# EAGLE board EPS (EAGLE 7.5.0)
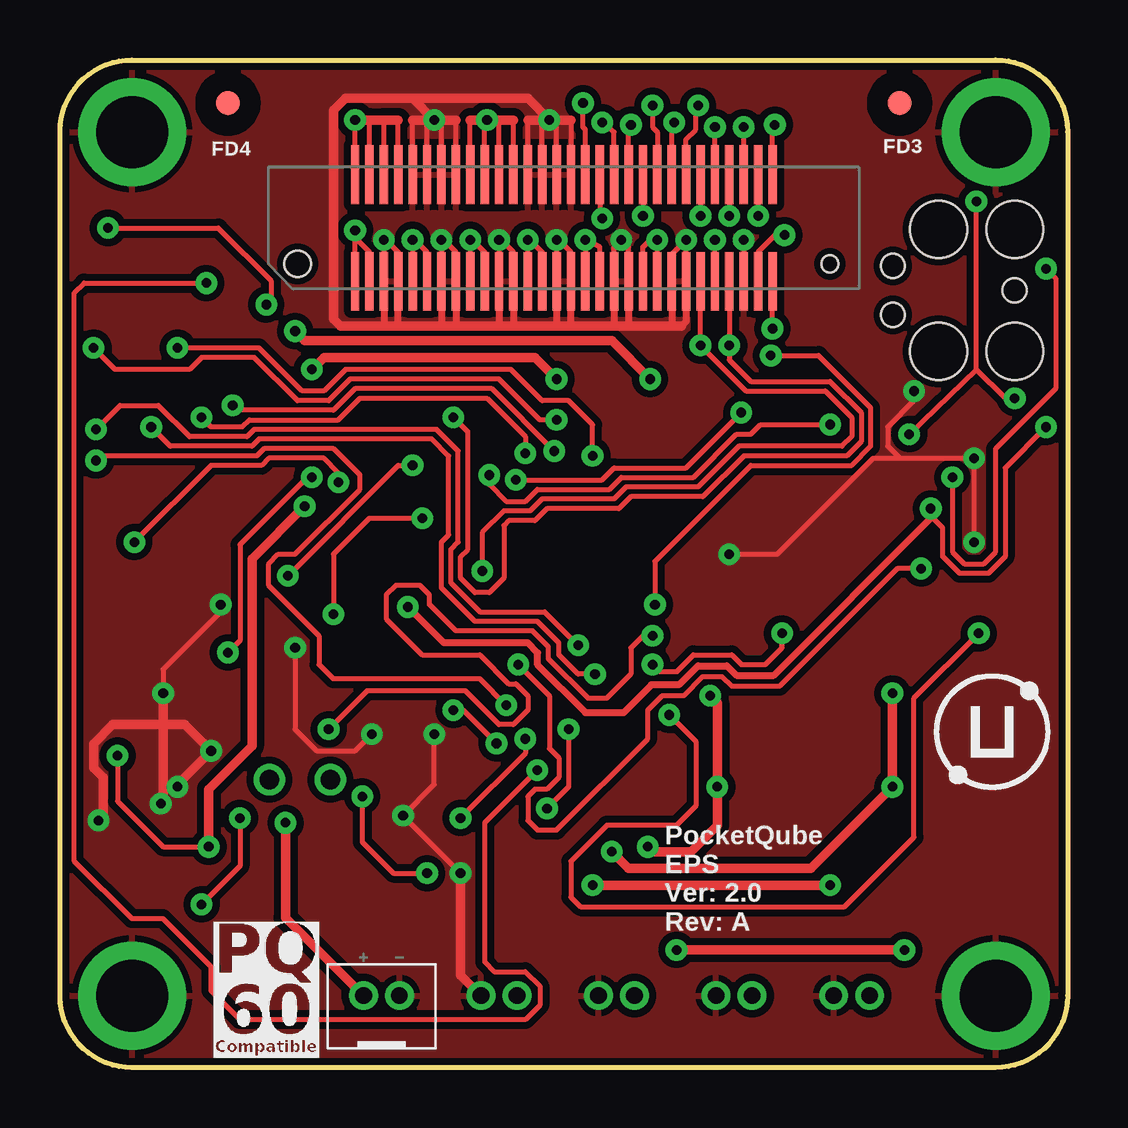
[diagram p3: board, top side]
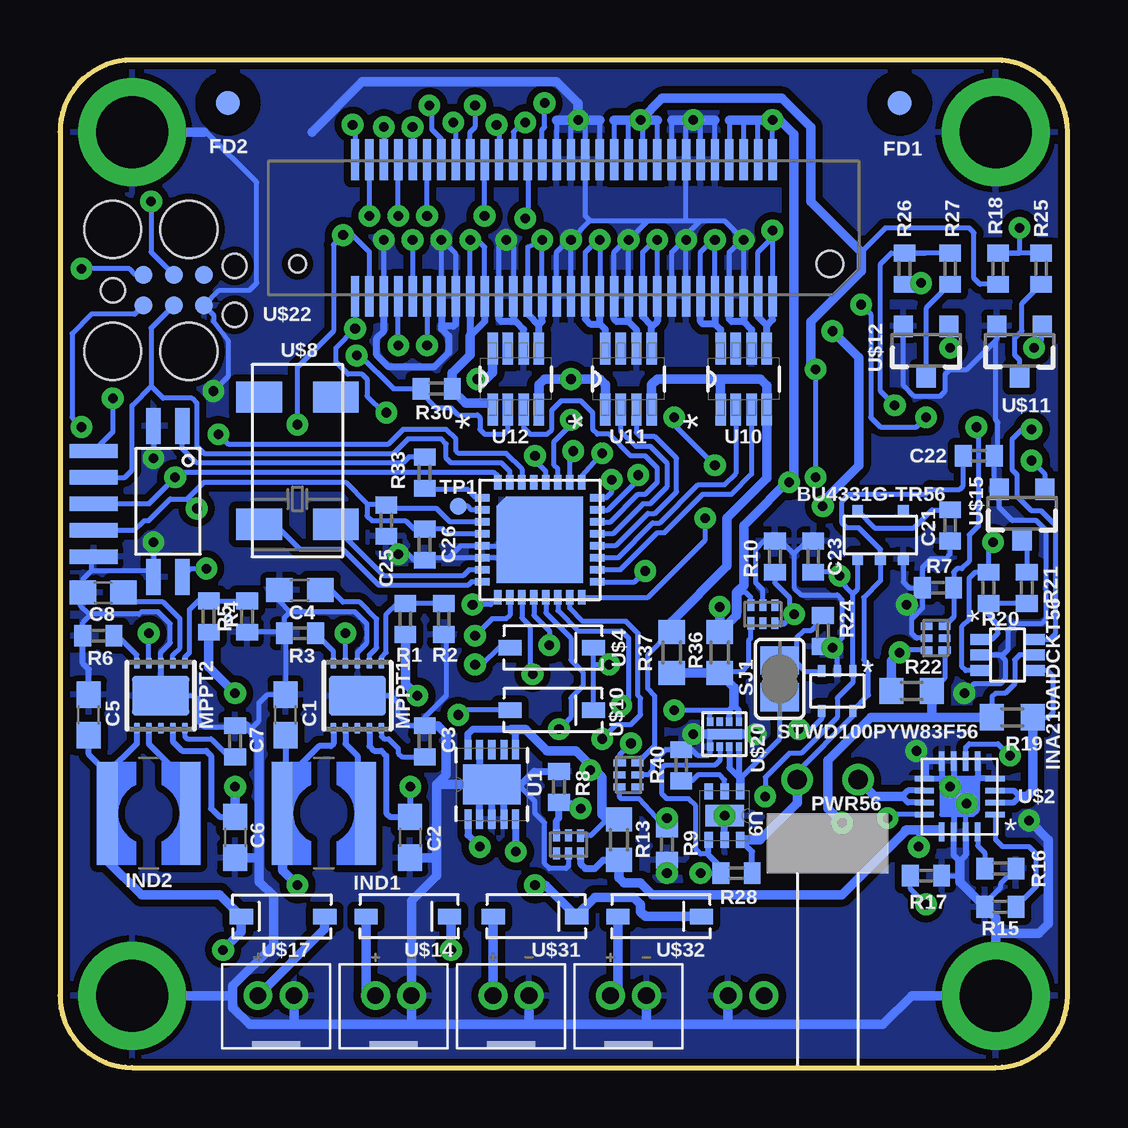
[diagram p4: board, bottom side, seen from below]

Size 42 x 42 mm. Coordinates in mm from the lower left corner, seen from the top.
Outline: 0,39 arc-90 3,42 39,42 arc-90 42,39 42,3 arc-90 39,0 3,0 arc-90 0,3 0,39
Copper layers (1*16): Top 0.035mm / dielectric 1.5mm / Bottom 0.035mm
Design rules "pcbtrain *": minimum track width 0.2mm, minimum drill 0.4mm, track to track 0.2mm, track to pad 0.2mm, pad to pad 0.2mm, via to via 0.2mm, smd to smd 0mil, copper to edge 10mil, drill to drill 0.2mm, minimum pad ring 10mil, minimum via ring 10mil, stop-mask expansion 0.125mm, vias tented up to drill 0.5mm, thermal gap 10mil
Milling: 8 lines

## Footprints (pad centres in the part's own frame; a part is rotated, then mirrored left to right if it is on the bottom)
JST-B2B-ZR = drill 0.7 pad 1.1: P$1 -0.75,0; P$2 0.75,0
SSOP5 = smd 0.45 x 0.5: 1 -0.95,-1; 2 0,-1; 3 0.95,-1; 4 0.95,1; 5 -0.95,1
C0603 = smd 1.1 x 1: 1 -0.85,0; 2 0.85,0
C0402 = smd 0.7 x 0.9: 1 -0.65,0; 2 0.65,0
FIDUCIAL_1MM = smd 1 x 1: 1 0,0
SC-70 = smd 0.45 x 0.9: 1 -0.65,-1.1; 2 0,-1.1; 3 0.65,-1.1; 4 0.65,1.1; 5 0,1.1; 6 -0.65,1.1
WE-TPC-744031100 = smd 4.3 x 0.85: P$1 0,-1.725; P$3 0,1.725
DFN-3X3 = smd 0.25 x 0.45: 1 -1,-1.35; 2 -0.5,-1.35; 3 0,-1.35; 4 0.5,-1.35; 5 1,-1.35; 6 1,1.35; 7 0.5,1.35; 8 0,1.35; 9 -0.5,1.35; 10 -1,1.35 | smd 2.38 x 1.65: EXP 0,0
FX8C-060P-SV(92) = smd 0.35 x 2.45: P$1 -8.7,-2.225; P$2 -8.1,-2.225; P$3 -7.5,-2.225; P$4 -6.9,-2.225; P$5 -6.3,-2.225; P$6 -5.7,-2.225; P$7 -5.1,-2.225; P$8 -4.5,-2.225; P$9 -3.9,-2.225; P$10 -3.3,-2.225; P$11 -2.7,-2.225; P$12 -2.1,-2.225; P$13 -1.5,-2.225; P$14 -0.9,-2.225; P$15 -0.3,-2.225; P$16 0.3,-2.225; P$17 0.9,-2.225; P$18 1.5,-2.225; P$19 2.1,-2.225; P$20 2.7,-2.225; P$21 3.3,-2.225; P$22 3.9,-2.225; P$23 4.5,-2.225; P$24 5.1,-2.225; P$25 5.7,-2.225; P$26 6.3,-2.225; P$27 6.9,-2.225; P$28 7.5,-2.225; P$29 8.1,-2.225; P$30 8.7,-2.225; P$31 8.7,2.225; P$32 8.1,2.225; P$33 7.5,2.225; P$34 6.9,2.225; P$35 6.3,2.225; P$36 5.7,2.225; P$37 5.1,2.225; P$38 4.5,2.225; P$39 3.9,2.225; P$40 3.3,2.225; P$41 2.7,2.225; P$42 2.1,2.225; P$43 1.5,2.225; P$44 0.9,2.225; P$45 0.3,2.225; P$46 -0.3,2.225; P$47 -0.9,2.225; P$48 -1.5,2.225; P$49 -2.1,2.225; P$50 -2.7,2.225; P$51 -3.3,2.225; P$52 -3.9,2.225; P$53 -4.5,2.225; P$54 -5.1,2.225; P$55 -5.7,2.225; P$56 -6.3,2.225; P$57 -6.9,2.225; P$58 -7.5,2.225; P$59 -8.1,2.225; P$60 -8.7,2.225 | hole 1.1: -11.1,-1.499 | hole 0.7: 11.1,-1.499
FX8C-060S-SV(92) = smd 0.35 x 1.7: P$1 -8.7,2.85; P$2 -8.1,2.85; P$3 -7.5,2.85; P$4 -6.9,2.85; P$5 -6.3,2.85; P$6 -5.7,2.85; P$7 -5.1,2.85; P$8 -4.5,2.85; P$9 -3.9,2.85; P$10 -3.3,2.85; P$11 -2.7,2.85; P$12 -2.1,2.85; P$13 -1.5,2.85; P$14 -0.9,2.85; P$15 -0.3,2.85; P$16 0.3,2.85; P$17 0.9,2.85; P$18 1.5,2.85; P$19 2.1,2.85; P$20 2.7,2.85; P$21 3.3,2.85; P$22 3.9,2.85; P$23 4.5,2.85; P$24 5.1,2.85; P$25 5.7,2.85; P$26 6.3,2.85; P$27 6.9,2.85; P$28 7.5,2.85; P$29 8.1,2.85; P$30 8.7,2.85; P$31 8.7,-2.85; P$32 8.1,-2.85; P$33 7.5,-2.85; P$34 6.9,-2.85; P$35 6.3,-2.85; P$36 5.7,-2.85; P$37 5.1,-2.85; P$38 4.5,-2.85; P$39 3.9,-2.85; P$40 3.3,-2.85; P$41 2.7,-2.85; P$42 2.1,-2.85; P$43 1.5,-2.85; P$44 0.9,-2.85; P$45 0.3,-2.85; P$46 -0.3,-2.85; P$47 -0.9,-2.85; P$48 -1.5,-2.85; P$49 -2.1,-2.85; P$50 -2.7,-2.85; P$51 -3.3,-2.85; P$52 -3.9,-2.85; P$53 -4.5,-2.85; P$54 -5.1,-2.85; P$55 -5.7,-2.85; P$56 -6.3,-2.85; P$57 -6.9,-2.85; P$58 -7.5,-2.85; P$59 -8.1,-2.85; P$60 -8.7,-2.85
961102-5604-AR = drill 0.8: PIN1 -1.27,0; PIN2 1.27,0
R0402 = smd 0.7 x 0.9: 1 -0.65,0; 2 0.65,0
R0603 = smd 1 x 1.1: 1 -0.85,0; 2 0.85,0
SJ = smd 1.168 x 1.6: 1 -0.762,0; 2 0.762,0
SOT_323-5 = smd 0.3 x 0.5: 1 0.65,0.825; 2 0,0.825; 3 -0.65,0.825; 4 -0.65,-0.825; 5 0.65,-0.825
TP07R = smd 0.7 x 0.7: TP 0,0
DFN300X300X80-11N = smd 0.813 x 0.305: 1 -1.448,0.991; 2 -1.448,0.508; 3 -1.448,0; 4 -1.448,-0.508; 5 -1.448,-0.991; 6 1.448,-0.991; 7 1.448,-0.508; 8 1.448,0; 9 1.448,0.508; 10 1.448,0.991 | smd 1.651 x 2.388: 11 0,0
SON65P200X200X80-7N = smd 0.66 x 0.356: 1 -1.016,0.66; 2 -1.016,0; 3 -1.016,-0.66; 4 1.016,-0.66; 5 1.016,0; 6 1.016,0.66 | smd 0.889 x 1.6: 7 0,0
SOT65P280X145-8N = smd 1.321 x 0.432: 1 -1.27,0.965; 2 -1.27,0.33; 3 -1.27,-0.33; 4 -1.27,-0.965; 5 1.27,-0.965; 6 1.27,-0.33; 7 1.27,0.33; 8 1.27,0.965
3MMPILAR = drill 3 pad 4.5: P$1 0,0
PVQFN16-THERM = smd 0.8 x 0.23: 1 -1.475,0.75; 2 -1.475,0.25; 3 -1.475,-0.25; 4 -1.475,-0.75; 9 1.475,-0.75; 10 1.475,-0.25; 11 1.475,0.25; 12 1.475,0.75 | smd 0.23 x 0.8: 5 -0.75,-1.475; 6 -0.25,-1.475; 7 0.25,-1.475; 8 0.75,-1.475; 13 0.75,1.475; 14 0.25,1.475; 15 -0.25,1.475; 16 -0.75,1.475 | smd 0.25 x 0.25: 17 0,0
DEBUG-TP = smd 0.6 x 2: P$1 0,0
SOD-123 = smd 0.97 x 0.65: P$1 -1.74,0; P$2 1.74,0
ABS25 = smd 1.3 x 1.9: 1 -2.65,-1.6; 2 2.65,-1.6; 3 2.65,1.6; 4 -2.65,1.6
SOT23-3 = smd 0.8 x 0.9: 1 -0.95,-1; 2 0.95,-1; 3 0,1.1
FAN4010IL6X_F113 = smd 0.3 x 0.52: 1 -0.5,-0.375 | smd 0.3 x 0.49: 2 0,-0.375; 3 0.5,-0.375; 4 0.5,0.375; 5 0,0.375; 6 -0.5,0.375
XDFN8 = smd 0.26 x 0.35: P$1 -0.6,-0.525; P$2 -0.2,-0.525; P$3 0.2,-0.525; P$4 0.6,-0.525; P$5 0.6,0.525; P$6 0.2,0.525; P$7 -0.2,0.525; P$8 -0.6,0.525 | smd 1.44 x 0.44: P$9 0,0
MKL02Z16VFM4 = smd 0.3 x 0.6: 1 -1.75,-2.4; 2 -1.25,-2.4; 3 -0.75,-2.4; 4 -0.25,-2.4; 5 0.25,-2.4; 6 0.75,-2.4; 7 1.25,-2.4; 8 1.75,-2.4; 17 1.75,2.4; 18 1.25,2.4; 19 0.75,2.4; 20 0.25,2.4; 21 -0.25,2.4; 22 -0.75,2.4; 23 -1.25,2.4; 24 -1.75,2.4 | smd 0.6 x 0.3: 9 2.4,-1.75; 10 2.4,-1.25; 11 2.4,-0.75; 12 2.4,-0.25; 13 2.4,0.25; 14 2.4,0.75; 15 2.4,1.25; 16 2.4,1.75; 25 -2.4,1.75; 26 -2.4,1.25; 27 -2.4,0.75; 28 -2.4,0.25; 29 -2.4,-0.25; 30 -2.4,-0.75; 31 -2.4,-1.25; 32 -2.4,-1.75 | smd 3.6 x 3.2: GND@1 0,0.2 | smd 0.566 x 1 rotated 315: GND@2 -1.246,-1.246 | smd 3.2 x 0.4: GND@3 0.2,-1.6
TAG_CONNECT = smd 0.75 x 0.75: 1 1.27,-0.635; 2 1.27,0.635; 3 2.54,-0.635; 4 2.54,0.635; 5 3.81,-0.635; 6 3.81,0.635 | hole 1: 0,0; 5.08,1.016; 5.08,-1.018 | hole 2.37: 0,-2.54; 3.175,-2.54; 0,2.54; 3.175,2.54
EL3H7 = smd 1.5 x 0.6: ANODE -3.15,0.6; CATHODE -3.15,-0.6; COLLECTOR 3.15,0.6; EMITTER 3.15,-0.6

## Placement (x,y rotation side)
BAT56  JST-B2B-ZH  [JST-B2B-ZR]  13.4,3 180 top
BU4331G-TR56  BU4231G-TR  [SSOP5]  7.8,22.2 0 bottom
C1  10uF  [C0603]  32.6,14.7 90 bottom
C2  10uF  [C0603]  27.4,9.6 270 bottom
C3  1uF  [C0402]  26.8,13.6 90 bottom
C4  10uF  [C0603]  32,19.9 180 bottom
C5  10uF  [C0603]  40.8,14.7 90 bottom
C6  10uF  [C0603]  34.7,9.6 270 bottom
C7  1uF  [C0402]  34.7,13.6 90 bottom
C8  10uF  [C0603]  40.2,19.8 180 bottom
C21  10nF  [C0402]  4.9,22.6 270 bottom
C22  1uF  [C0402]  3.7,25.5 0 bottom
C23  1nF  [C0402]  10.6,21.3 90 bottom
C25  1uF  [C0402]  28.4,22.8 270 bottom
C26  1uF  [C0402]  26.8,21.8 270 bottom
FD1  FIDUCIAL  [FIDUCIAL_1MM]  7,40.2 0 bottom
FD2  FIDUCIAL  [FIDUCIAL_1MM]  35,40.2 0 bottom
FD3  FIDUCIAL  [FIDUCIAL_1MM]  35,40.2 0 top
FD4  FIDUCIAL  [FIDUCIAL_1MM]  7,40.2 0 top
INA210AIDCKT56  INA211A  [SC-70]  2.5,17.2 270 bottom
IND1  WE-TPC-744031100  [WE-TPC-744031100]  31,10.6 90 bottom
IND2  WE-TPC-744031100  [WE-TPC-744031100]  38.3,10.6 90 bottom
MPPT1  LTC3105  [DFN-3X3]  29.6,15.5 180 bottom
MPPT2  LTC3105  [DFN-3X3]  37.8,15.5 180 bottom
PQ60_HEADER56  FX8C-060P-SV2(92)  [FX8C-060P-SV(92)]  21,35 0 top
PQ60_RECEPTACLE56  FX8C-060S-SV(92)  [FX8C-060S-SV(92)]  21,35 180 bottom
PWR56  961102-5604-AR  [961102-5604-AR]  10,12 0 bottom
R1  1.3M  [R0402]  27.6,18.7 270 bottom
R2  330K  [R0402]  26,18.7 90 bottom
R3  501K  [R0402]  32,18.1 180 bottom
R4  1.3M  [R0402]  35.8,18.8 270 bottom
R5  330K  [R0402]  34.2,18.8 90 bottom
R6  501K  [R0402]  40.4,18 180 bottom
R7  10K  [R0402]  5.4,20 180 bottom
R8  10K  [R0402]  21.2,11.7 270 bottom
R9  10K  [R0402]  16.7,9.3 90 bottom
R10  10K  [R0402]  12.2,21.3 270 bottom
R13  0.15R, 1%  [R0603]  18.7,9.5 270 bottom
R15  10K  [R0402]  2.8,6.7 0 bottom
R16  2.2K  [R0402]  2.8,8.3 180 bottom
R17  3.3K  [R0402]  5.9,8 180 bottom
R18  10K  [R0402]  2.9,33.3 270 bottom
R19  0.015R 1%  [R0603]  2.3,14.6 0 bottom
R20  10K  [R0402]  3.3,20 90 bottom
R21  10K  [R0402]  1.7,20 270 bottom
R22  0.15R, 1%  [R0603]  6.5,15.7 0 bottom
R24  10K  [R0402]  10.2,18.2 90 bottom
R25  10K  [R0402]  1.1,33.3 90 bottom
R26  10K  [R0402]  6.8,33.3 270 bottom
R27  10K  [R0402]  4.9,33.3 90 bottom
R28  10K  [R0402]  13.8,8.1 0 bottom
R30  10K  [R0402]  26.3,28.3 0 bottom
R33  150R  [R0402]  26.8,24.8 90 bottom
R36  0.15R, 1%  [R0603]  14.5,17.3 90 bottom
R37  0.15R, 1%  [R0603]  16.5,17.3 90 bottom
R40  47K  [R0402]  16.1,12.6 270 bottom
SJ1  [SJ]  12,16.2 90 bottom
SOL1  JST-B2B-ZH  [JST-B2B-ZR]  18.3,3 180 bottom
SOL2  JST-B2B-ZH  [JST-B2B-ZR]  23.2,3 180 bottom
SOL3  JST-B2B-ZH  [JST-B2B-ZR]  28.1,3 180 bottom
SOL4  JST-B2B-ZH  [JST-B2B-ZR]  33,3 180 bottom
STWD100PYW83F56  STWD100PYW83F  [SOT_323-5]  9.6,15.7 0 bottom
TP1  TPTP07R  [TP07R]  25.4,23.4 0 bottom
U1  LTC4413EDDPBF  [DFN300X300X80-11N]  24,11.8 90 bottom
U9  TPS2553DRVT  [SON65P200X200X80-7N]  14.3,10.5 270 bottom
U10  TPS22960DCNR  [SOT65P280X145-8N]  13.5,28.7 90 bottom
U11  TPS22960DCNR  [SOT65P280X145-8N]  18.3,28.7 90 bottom
U12  TPS22960DCNR  [SOT65P280X145-8N]  23,28.7 90 bottom
U$1  3MMPILAR  [3MMPILAR]  3,3 0 top
U$2  BQ24079  [PVQFN16-THERM]  4.5,11.3 180 bottom
U$3  DEBUG-TP  [DEBUG-TP]  40.6,22.4 90 bottom
U$4  BAT41  [SOD-123]  21.5,17.5 180 bottom
U$5  3MMPILAR  [3MMPILAR]  3,39 0 top
U$6  3MMPILAR  [3MMPILAR]  39,3 0 top
U$7  3MMPILAR  [3MMPILAR]  39,39 0 top
U$8  ABS25_32.768KHZ  [ABS25]  32.1,25.3 90 bottom
U$9  [SA_LOGO_SMALL]  34.1,7.7 0 top
U$10  BAT41  [SOD-123]  21.5,14.9 180 bottom
U$11  PMV40UN2  [SOT23-3]  2,29.9 180 bottom
U$12  PMV40UN2  [SOT23-3]  5.9,29.9 180 bottom
U$13  [PQ60_CMP]  6.4,0.4 0 top
U$14  BAT41  [SOD-123]  27.5,6.3 180 bottom
U$15  PMV40UN2  [SOT23-3]  1.9,23.1 180 bottom
U$16  DEBUG-TP  [DEBUG-TP]  40.6,24.6 90 bottom
U$17  BAT41  [SOD-123]  32.7,6.3 0 bottom
U$18  FAN4010IL6X_F113  [FAN4010IL6X_F113]  20.8,9.3 180 bottom
U$19  FAN4010IL6X_F113  [FAN4010IL6X_F113]  5.5,17.9 90 bottom
U$20  NCP706AMX300TAG  [XDFN8]  14.3,13.9 180 bottom
U$21  MKL02Z16VFM4  [MKL02Z16VFM4]  22,22 270 bottom
U$22  TAG_CONNECT  [TAG_CONNECT]  39.8,32.4 0 bottom
U$23  DEBUG-TP  [DEBUG-TP]  40.6,21.3 90 bottom
U$24  EL3H7  [EL3H7]  37.5,23.6 270 bottom
U$25  FAN4010IL6X_F113  [FAN4010IL6X_F113]  12.7,18.9 0 bottom
U$26  FAN4010IL6X_F113  [FAN4010IL6X_F113]  18.3,12.2 270 bottom
U$27  DEBUG-TP  [DEBUG-TP]  40.6,25.7 90 bottom
U$28  DEBUG-TP  [DEBUG-TP]  40.6,23.5 90 bottom
U$31  BAT41  [SOD-123]  22.2,6.3 180 bottom
U$32  BAT41  [SOD-123]  17,6.3 180 bottom
U$35  [UBO_LOGO]  36.4,11.5 0 top

## Tracks (layer width: path | path; a pad name or v marks a point on that pad's centre or on a via)
+3V3  (via drill 0.4)
  Top 0.2: PQ60_HEADER56.P$57 14.1,39.5 | PQ60_HEADER56.P$58 13.5,39.5 | PQ60_HEADER56.P$59 12.9,39.5 | PQ60_HEADER56.P$60 v12.3,39.5 | v41.1,26.7 39.4,25 39.4,21.3 38.7,20.6 37.5,20.6 36.8,21.3 36.8,22.5 36.3,23 v36.3,23.3 | v11.6,24.4 11.6,24.8 11,25.4 8.7,25.4 8.4,25.1 6.3,25.1 v3.1,21.9
  Top 0.3: v36.3,23.3 36.3,22.9 29.75,16.35 28.2,16.35 27.8,16.75 26.6,16.75 25.8,15.95 24.65,15.95 23.5,14.8 21.9,14.8 19.91,16.79 19.91,17.29 19.5,17.7 16,17.7 v14.5,19.2
  Top 0.4: 14.1,39.5 13.5,39.5 12.9,39.5 v12.3,39.5
  Bottom 0.2: PQ60_RECEPTACLE56.P$60 v12.3,39.5 | 14.1,39.5 PQ60_RECEPTACLE56.P$57 | PQ60_RECEPTACLE56.P$58 13.5,39.5 | PQ60_RECEPTACLE56.P$59 12.9,39.5 | INA210AIDCKT56.3 4.25,16.55 4.4,16.7 4.4,18.4 4.1,18.7 4.1,20.4 3.85,20.65 R20.2 3.3,21.7 v3.1,21.9 | U$21.3 25.75,22.75 26.3,23.3 28.25,23.3 C25.1 28.45,23.5 29.2,23.5 | U$21.4 25.85,22.25 26.05,22.45 C26.1 27.25,22.45 27.6,22.8 29,22.8 29.2,23 29.2,23.5 | U$22.1 38.9,31.4 40.7,31.4 41.5,30.6 41.5,27.1 v41.1,26.7 | U$3.P$1 38.9,22.4 38.5,22.8 38.3,22.8 37.4,23.7 36.7,23.7 | 29.2,23.5 30.1,24.4 36,24.4 36.7,23.7 | v36.3,23.3 36.7,23.7 | 13.8,18.85 13.7,18.95 13.7,19.7 13.6,19.8 13.4,19.8 13.2,19.6 U$25.6 | 11.4,24.7 11.6,24.5 v11.6,24.4
  Bottom 0.4: 14.1,39.5 13.5,39.5 12.9,39.5 v12.3,39.5 12,39.5 11.4,38.9 11.4,24.7 13.5,22.6 13.5,20.1 13.8,19.8 13.8,18.85 R36.2 v14.5,19.2
+3V3_ISEN  (via drill 0.4)
  Top 0.2: v11.4,18.9 11.4,21.4 12.9,22.9 v15.1,22.9
  Bottom 0.2: R10.2 12.2,20.2 11.6,19.6 11.6,19.1 | 11.78,18.52 11.6,18.7 11.6,19.1 | 11.78,18.52 U$25.3 12.07,18.5 11.8,18.5 11.78,18.52 | 11.6,19.1 v11.4,18.9 | U$21.16 17.5,19.6 15.1,22 v15.1,22.9
+3V3_REG  (via drill 0.4)
  Top 0.2: v16.4,14.9 16.81,14.9 v18.2,13.51
  Bottom 0.2: U$20.P$4 14.9,14.8 14.8,14.9 | 14.8,14.9 14.1,14.9 | R36.1 14.45,16.5 13.6,16.5 13.3,16.8 13.3,17.8 13.2,17.9 U$25.1 | v16.4,14.9 14.8,14.9 | v18.2,13.51 18.68,13.04 U$26.1
  Bottom 0.25: U$20.P$1 13.7,14.9 13.9,15.1 14.1,14.9 U$20.P$2
  Bottom 0.4: 13.9,15.1 13.9,15.85 R36.1 R37.1
+3V3_SW
  Bottom 0.2: U$26.6 17.2,13.43 17.2,15.5 17.5,15.8 17.5,17.2 16.55,18.15 R37.2
  Bottom 0.4: 14.7,28.7 12.8,28.7 12.54,28.43 U10.4 12.54,24.57 14.2,22.9 14.2,20.9 16.5,18.6 R37.2 | 14.7,28.7 17.1,28.7 17.34,28.46 U11.4 | U10.1 14.46,28.46 14.7,28.7
+3V3_SW1  (via drill 0.4)
  Top 0.2: PQ60_HEADER56.P$1 12.3,34.6 | PQ60_HEADER56.P$2 12.9,34 12.3,34.6 | 12.3,34.6 v12.3,34.9
  Bottom 0.2: PQ60_RECEPTACLE56.P$2 PQ60_HEADER56.P$2 12.9,34 12.3,34.6 | v12.3,34.9 12.3,34.6 | 12.3,34.6 PQ60_RECEPTACLE56.P$1
  Bottom 0.3: U10.5 12.54,30.93 12.3,31.17 PQ60_RECEPTACLE56.P$1 | PQ60_HEADER56.P$2 12.9,31.3 12.6,31
+3V3_SW1_EN
  Bottom 0.2: U10.3 13.17,24.73 14,23.9 15.2,23.9 16.8,22.3 17.1,22.3 18.65,20.75 U$21.18
+3V3_SW2  (via drill 0.4)
  Top 0.2: PQ60_HEADER56.P$5 v14.7,34.5 14.8,34.5 15.3,34 PQ60_HEADER56.P$6
  Bottom 0.2: 14.77,32.15 PQ60_RECEPTACLE56.P$5 v14.7,34.5 14.8,34.5 15.3,34 PQ60_RECEPTACLE56.P$6
  Bottom 0.3: PQ60_RECEPTACLE56.P$5 14.7,31 | U10.8 14.46,30.77 14.7,31 | 14.7,31 15.2,31 15.3,31.1 PQ60_RECEPTACLE56.P$6
+3V3_SW2_EN
  Bottom 0.2: U10.2 13.83,24.77 14.3,24.3 15.4,24.3 17,22.7 17.3,22.7 18.75,21.25 U$21.19
+3V3_SW3  (via drill 0.4)
  Top 0.2: PQ60_HEADER56.P$9 v17.1,34.5 17.2,34.5 17.7,34 PQ60_HEADER56.P$10
  Bottom 0.2: PQ60_RECEPTACLE56.P$10 PQ60_HEADER56.P$10 | PQ60_HEADER56.P$10 17.7,34 17.2,34.5 v17.1,34.5 PQ60_RECEPTACLE56.P$9 17.1,32.1 | 17.64,32.71 PQ60_HEADER56.P$10
  Bottom 0.3: 17.1,32.1 17.1,31.1 17.34,30.86 | U11.5 17.34,30.93 17.7,31.3 PQ60_HEADER56.P$10
+3V3_SW3_EN
  Bottom 0.2: U11.3 17.97,26.47 17.8,26.3 17.2,26.3 16.3,25.4 16.3,24 17.2,23.1 17.5,23.1 18.85,21.75 U$21.20
+3V3_SW_ISEN  (via drill 0.4)
  Top 0.2: v19.4,13.7 19.4,13.1 v16.7,10.4
  Bottom 0.2: U$26.3 18.68,11.28 18.6,11.2 17.85,11.2 R9.2 v16.7,10.4 | U$21.15 20.75,19.15 20.2,18.6 18.4,18.6 17.9,18.1 17.9,15.5 17.8,15.4 17.8,14.7 18.2,14.3 18.8,14.3 v19.4,13.7
+5V_USB  (via drill 0.4)
  Top 0.2: PQ60_HEADER56.P$22 v24.9,34.5 24.6,34.5 24.3,34.2 PQ60_HEADER56.P$21
  Bottom 0.2: PQ60_RECEPTACLE56.P$22 v24.9,34.5 24.6,34.5 24.3,34.2 PQ60_RECEPTACLE56.P$21
  Bottom 0.3: 24.9,31.55 24.9,30.5 24.3,31.1 PQ60_RECEPTACLE56.P$21
  Bottom 0.4: 24.9,30.5 24.9,29.7 25.65,28.95 R30.2 25.65,28.25 25.1,27.7 23.96,27.7 U12.1
BAT_BUS_ISEN  (via drill 0.4)
  Top 0.2: v3.8,26.7 4.6,25.9 8,25.9 8.3,26.2 15.5,26.2 16.2,25.5 16.2,22.2 15.9,21.9 15.9,20 17.3,18.6 19.9,18.6 20.8,17.7 20.8,17.2 21.6,16.4 v22.3,16.4
  Bottom 0.2: U$19.3 4.75,18.77 R7.1 4.75,20.65 4.6,20.8 4.4,20.8 4.1,21.1 4.1,22.2 3.7,22.6 3.7,26.6 v3.8,26.7 | U$21.11 22.75,18.75 22.4,18.4 22.4,16.5 v22.3,16.4
BAT_RAW_ISEN  (via drill 0.4)
  Top 0.2: v1.5,26.6 2.5,27.6 4.1,27.6 5.4,26.3 7.8,26.3 8.1,26.6 15.7,26.6 16.6,25.7 16.6,21.9 16.3,21.6 16.3,20.2 17.5,19 20.2,19 v21.6,17.6
  Bottom 0.2: INA210AIDCKT56.6 0.75,17.85 0.5,18.1 0.5,22.6 1.1,23.2 1.5,23.2 2.1,23.8 2.1,24.7 2.3,24.9 2.3,26.2 1.9,26.6 v1.5,26.6 | U$21.12 22.25,18.85 21.6,18.2 v21.6,17.6
BAT_RAW_ISEN_EN  (via drill 0.4)
  Top 0.2: v18.6,15.1 17.5,16.2 11.4,16.2 10.8,16.8 10.8,18 8.7,20.1 8.7,21 9.1,21.4 9.8,21.4 12.5,24.1 12.5,24.7 11.4,25.8 8.5,25.8 8.2,25.5 1.7,25.5 v1.5,25.3
  Bottom 0.2: U$21.14 21.25,19.05 20.4,18.2 18.6,18.2 18.3,17.9 18.3,15.4 v18.6,15.1 | v1.5,25.3 0.95,24.75 U$15.1
BATV_BUS  (via drill 0.4)
  Top 0.2: PQ60_HEADER56.P$52 17.1,39.5 | PQ60_HEADER56.P$51 17.7,39.5 v17.8,39.5 18.3,39.5 PQ60_HEADER56.P$50 | PQ60_HEADER56.P$49 18.9,39.5 | v7,17.3 7.5,17.8 7.5,21.8 10.3,24.6 v10.5,24.6
  Top 0.4: 17.1,39.5 v17.8,39.5 18.9,39.5 | v20.7,28.7 19.8,29.6 11,29.6 v10.5,29.1
  Bottom 0.2: 18.9,39.5 PQ60_RECEPTACLE56.P$49 | PQ60_RECEPTACLE56.P$51 17.7,39.5 | PQ60_RECEPTACLE56.P$50 18.3,39.5 | PQ60_RECEPTACLE56.P$52 17.1,39.5 v17.8,39.5 | U$19.6 6.9,17.4 v7,17.3 | R18.2 3.65,32.65 3.9,32.9 3.9,34.8 4.1,35 7.6,35 8.6,34 | v10.5,24.6 v10.5,29.1
  Bottom 0.4: 17.1,39.5 17.7,39.5 | 18.9,39.5 18.3,39.5 v17.8,39.5 16.9,40.4 11.9,40.4 10.7,39.2 10.7,36.1 8.6,34 8.6,33.2 10.7,31.1 10.7,29.3 v10.5,29.1 | R22.1 7.35,16.95 v7,17.3 | U12.4 22.04,28.46 21.8,28.7 v20.7,28.7 19.5,28.7 19.27,28.46 U11.1
BATV_SENS  (via drill 0.4)
  Top 0.2: v2,35 6.6,35 8.8,32.8 8.8,32 v8.6,31.8 | v19.4,25.6 19.4,26.3 17.8,27.9 12.5,27.9 11.6,27 7.9,27 7.6,26.7 6.3,26.7 v5.9,27.1
  Bottom 0.2: U$21.25 20.25,24.65 v19.4,25.6 | R25.2 R18.1 2,33.95 v2,35 | v8.6,31.8 8.2,31.4 8.2,27.1 7.8,26.7 6.3,26.7 v5.9,27.1
BATV_SENS_EN  (via drill 0.4)
  Top 0.2: v20.7,27 20,27 18.3,28.7 12.1,28.7 11.2,27.8 9.9,27.8 8.1,29.6 5.9,29.6 5.4,29.1 2.3,29.1 v1.4,30
  Bottom 0.2: U$21.27 21.25,24.95 21.4,25.1 21.4,26.1 20.7,26.8 v20.7,27 | U$11.1 1.1,30.9 1.1,30.3 v1.4,30
BATV_SW1  (via drill 0.4)
  Top 0.2: PQ60_HEADER56.P$13 v19.5,34.5 19.6,34.5 20.1,34 PQ60_HEADER56.P$14
  Bottom 0.2: PQ60_RECEPTACLE56.P$13 v19.5,34.5 19.6,34.5 20.1,34 20.1,32.7 PQ60_RECEPTACLE56.P$14 20.1,32.1
  Bottom 0.3: U11.8 19.27,30.77 19.5,31 | 19.5,31 PQ60_RECEPTACLE56.P$13 | 20.1,32.7 20.1,31.2 19.9,31 19.5,31
BATV_SW1_EN
  Bottom 0.2: U11.2 18.63,26.53 18,25.9 17.4,25.9 16.7,25.2 16.7,24.2 17.4,23.5 17.7,23.5 18.95,22.25 U$21.21
BATV_SW2  (via drill 0.4)
  Top 0.2: PQ60_HEADER56.P$17 v21.9,34.5 22.5,34.2 PQ60_HEADER56.P$18
  Bottom 0.2: 22.54,32.12 PQ60_RECEPTACLE56.P$18 22.5,34.2 v21.9,34.5 PQ60_RECEPTACLE56.P$17 21.9,31.8
  Bottom 0.3: PQ60_RECEPTACLE56.P$18 22.5,31.4 22.04,30.93 | U12.5 22.04,30.96 21.9,31.1 PQ60_RECEPTACLE56.P$17
BATV_SW2_EN
  Bottom 0.2: U12.3 22.67,26.67 22.4,26.4 21.7,26.4 21.5,26.6 21.5,27.4 21.1,27.8 20.3,27.8 19.8,27.3 19.8,26.6 19.6,26.4 19.1,26.4 18.2,25.5 17.6,25.5 17.1,25 17.1,24.4 17.6,23.9 17.9,23.9 19.05,22.75 U$21.22
CHG_INPUT  (via drill 0.4)
  Top 0.2: v2.4,13 2.4,11.1 4.3,9.2 v6.2,9.2
  Top 0.4: v24.6,28.7 23,30.3 10.2,30.3 v9.8,30.7 | v6.2,9.2 6.2,11.6 8,13.4 8,21.2 v10.2,23.4
  Bottom 0.2: U$2.13 arc-90 5.33,9.9 5.34,9.9 | U$2.6 4.25,13.35 4.1,13.5 2.9,13.5 v2.4,13 | v6.2,9.2 6.2,9.9
  Bottom 0.3: U$18.6 20.3,8.5 20.1,8.3 19.7,8.3 19.35,8.65 R13.2
  Bottom 0.4: 5.34,9.9 6.2,9.9 6.7,9.9 arc-90 6.78,9.82 9.4,7.2 17.3,7.2 17.8,7.7 18.5,7.7 18.7,7.9 R13.2 | U12.8 23.96,28.96 24.23,28.7 v24.6,28.7 | v9.8,30.7 8.7,29.6 8.7,25.1 10.2,23.6 v10.2,23.4
EN  (via drill 0.4)
  Top 0.2: PQ60_HEADER56.P$27 v27.9,30.1 27.9,29.5 28.8,28.6 32.1,28.6 33.4,27.3 33.4,26.1 32.8,25.5 28.5,25.5 26.8,23.8 23.8,23.8 23.3,23.3 20.3,23.3 19.8,22.8 18.7,22.8 18.5,22.6 18.5,20.4 17.9,19.8 17.3,19.8 16.7,20.4 16.7,21.3 17,21.6 17,26.5 v16.4,27.1 | v12.6,11.3 12.6,9.4 13.9,8.1 v15.3,8.1 | v9.5,20.5 14.1,25.1 v14.7,25.1
  Bottom 0.2: v27.9,30.1 PQ60_RECEPTACLE56.P$27 | U$20.P$6 14.5,12.8 14.7,12.6 16.8,12.6 16.9,12.5 16.9,11.4 16.7,11.2 15.8,11.2 15.5,10.9 15.5,9.1 15.3,8.9 15,8.9 14.96,8.94 U9.4 | v12.6,11.3 12.6,12.1 11.6,13.1 11.1,13.1 9.6,14.6 9.6,15.4 8.95,16.05 STWD100PYW83F56.1 8.95,19.75 | 8.95,19.75 8.75,19.95 BU4331G-TR56.1 | 8.95,19.75 9.5,20.3 v9.5,20.5 9.65,20.65 C23.1 | v15.3,8.1 R28.1 | v14.7,25.1 16.4,26.8 v16.4,27.1
  Bottom 0.25: R28.1 14.45,8.35 14.96,8.86 U9.4
EXTAL
  Bottom 0.2: U$21.7 24.95,20.75 25.2,20.5 28.5,20.5 30.5,22.5 U$8.1
GND  (via drill 0.4)
  Top 0.2: PQ60_HEADER56.P$56 14.7,39.5 | PQ60_HEADER56.P$55 15.3,39.5 v15.6,39.5 | PQ60_HEADER56.P$54 15.9,39.5 | PQ60_HEADER56.P$53 16.5,39.5 | PQ60_HEADER56.P$3 13.5,33.4 v13.5,34.5 13.6,34.5 14.1,34 14.1,33.3 PQ60_HEADER56.P$4 | PQ60_HEADER56.P$7 15.9,33.2 v15.9,34.5 16,34.5 16.5,34 16.5,33.1 PQ60_HEADER56.P$8 | PQ60_HEADER56.P$11 18.3,33 v18.3,34.5 18.4,34.5 18.9,34 18.9,33 PQ60_HEADER56.P$12 | PQ60_HEADER56.P$15 v20.7,34.5 20.8,34.5 21.3,34 PQ60_HEADER56.P$16 | PQ60_HEADER56.P$19 23.1,34.2 v23.4,34.5 23.7,34.2 23.7,33.3 PQ60_HEADER56.P$20 | v28.5,34.5 PQ60_HEADER56.P$28 | PQ60_HEADER56.P$23 25.5,33.9 v26.1,34.5 26.1,33.2 PQ60_HEADER56.P$24 26.1,32.4 | PQ60_HEADER56.P$48 19.5,39.5 | v20.4,39.5 20.1,39.5 PQ60_HEADER56.P$47 | 20.9,39.5 20.7,39.5 PQ60_HEADER56.P$46 | 21.3,39.5 PQ60_HEADER56.P$45 | v4.3,15.6 4.3,16.6 6.7,19 v6.7,19.3 | v38.1,21.9 v38.1,25.4 35,25.4 | v35.6,28.2 35.6,27.8 34.5,26.7 34.5,25.9 35,25.4 | v16.7,8.1 U9.7 15.6,11.8 v15.6,13.9 | v27.9,21.4 29.9,21.4 33.9,25.4 35,25.4 | v9.8,17.5 9.8,14.1 10.7,13.2 12.3,13.2 v13,13.9
  Top 0.3: PQ60_HEADER56.P$23 25.5,30.9 | 26.1,33.2 26.1,31.1 25.9,30.9 | 23.7,33.3 23.7,30.9 | PQ60_HEADER56.P$19 23.1,30.9 | 21.3,30.9 PQ60_HEADER56.P$16 | 20.7,32.7 20.7,30.9 | 18.9,33 18.9,30.9 | 18.3,33 18.3,30.9 | 16.5,33.1 16.5,30.9 | 15.9,33.2 15.9,30.9 | 13.5,33.4 13.5,30.9 | 14.1,30.9 14.1,33.3
  Top 0.4: v15.6,39.5 15.9,39.5 | 14.7,39.5 v15.6,39.5 | v15.6,39.5 16.5,39.5 | 19.5,39.5 20.1,39.5 | 20.9,39.5 21.3,39.5 | 20.7,39.5 v20.4,39.5 19.5,40.4 14.7,40.4 | v4.3,15.6 4.3,14.3 | v4.9,11.7 4.9,11.8 v6.3,13.2 5.2,14.3 4.3,14.3 | 4.3,14.3 2.2,14.3 1.4,13.5 1.4,12.5 1.8,12.1 1.8,10.5 v1.6,10.3 | 4.3,14.3 4.3,11.1 v4.2,11 | 25.9,30.9 25.5,30.9 23.7,30.9 23.1,30.9 21.3,30.9 20.7,30.9 18.9,30.9 18.3,30.9 16.5,30.9 15.9,30.9 14.1,30.9 13.5,30.9 11.7,30.9 11.4,31.2 11.4,39.9 11.9,40.4 14.7,40.4 | v15.6,39.5 14.7,40.4 | v16.7,8.1 16.7,3.85 SOL1.P$1
  Bottom 0.2: PQ60_RECEPTACLE56.P$56 14.7,39.5 | PQ60_RECEPTACLE56.P$55 15.3,39.5 v15.6,39.5 15.9,39.5 PQ60_RECEPTACLE56.P$54 15.9,35.3 | PQ60_RECEPTACLE56.P$53 16.5,39.5 | PQ60_RECEPTACLE56.P$3 v13.5,34.5 | v18.3,34.5 PQ60_RECEPTACLE56.P$11 18.27,32.12 | PQ60_RECEPTACLE56.P$19 23.1,34.2 v23.4,34.5 23.7,34.2 PQ60_RECEPTACLE56.P$20 | PQ60_RECEPTACLE56.P$24 v26.1,34.5 25.5,33.9 PQ60_RECEPTACLE56.P$23 | PQ60_RECEPTACLE56.P$28 v28.5,34.5 | PQ60_RECEPTACLE56.P$4 14.1,34 13.6,34.5 v13.5,34.5 | PQ60_RECEPTACLE56.P$8 16.5,34 16,34.5 v15.9,34.5 | PQ60_RECEPTACLE56.P$12 PQ60_HEADER56.P$12 18.9,34 18.4,34.5 v18.3,34.5 | PQ60_RECEPTACLE56.P$16 21.3,34 20.8,34.5 v20.7,34.5 | PQ60_RECEPTACLE56.P$48 19.5,39.5 | 21.3,39.5 PQ60_RECEPTACLE56.P$45 | PQ60_RECEPTACLE56.P$46 20.7,39.5 | 20.1,39.5 PQ60_RECEPTACLE56.P$47 20.1,35.5 19.9,35.3 | PQ60_RECEPTACLE56.P$7 v15.9,34.5 | v15.9,34.5 15.9,34.7 15.3,35.3 | 15.3,35.3 14.3,35.3 v13.5,34.5 | 17.5,35.3 v18.3,34.5 | PQ60_RECEPTACLE56.P$15 v20.7,34.5 | v20.7,34.5 19.9,35.3 | 19.9,35.3 17.5,35.3 | 17.5,35.3 15.9,35.3 | 15.9,35.3 15.3,35.3 | MPPT2.3 37.8,17.3 37.4,17.7 37.4,18.5 37.9,19 38.6,19 38.7,18.9 40.7,18.9 | R6.2 41.05,18.55 40.7,18.9 | 40.7,18.9 40.8,18.9 41.15,19.25 C8.2 41.05,20.35 40.7,20.7 | MPPT2.EXP 36.4,15.5 36.2,15.3 36.2,14.4 36,14.2 34.75,14.2 C7.2 | MPPT1.3 29.6,17.3 29.2,17.7 29.2,18.5 29.7,19 32.4,19 | 32.4,19 32.65,18.75 R3.2 | 32.4,19 32.85,19.45 C4.2 | R3.2 32.7,18.15 R5.1 | R3.2 32.6,18.05 C1.2 33.35,15.55 33.7,15.2 33.7,14.45 34.05,14.1 34.1,14.1 | MPPT1.EXP 28.2,15.5 27.9,15.2 27.9,14.7 27.45,14.25 C3.2 26.8,14.6 25.9,15.5 25.9,17.95 R2.1 | R16.1 2.8,7.65 2.8,7.5 3.45,6.85 R15.1
  Bottom 0.2: U$2.15 4.25,11.05 U$2.17 | R17.1 4.5,8 | U$18.5 20.8,8.4 20.9,8.3 21.6,8.3 21.8,8.5 21.8,10.2 22.2,10.6 22.2,11.1 22.84,11.74 | R7.2 6.05,19.15 6.5,18.7 | v4.3,15.6 3.9,16 2.8,16 2.6,16.2 2.6,17 2.8,17.2 INA210AIDCKT56.2 2.7,17.2 2.5,17.4 2.5,18.2 2.2,18.5 1.1,18.5 0.9,18.7 0.9,22.4 1.3,22.8 2.3,22.8 2.85,23.35 U$15.2 3.05,24.1 C22.2 2.9,25.65 2.9,26.9 3,27 3,30.3 | U$19.5 6.3,17.9 6.5,18.1 6.5,18.7 | U$20.P$5 14.9,13.1 15,13 15.4,13 15.65,13.25 R40.1 16.75,13.25 17.3,12.7 17.3,12.4 17.5,12.2 U$26.5 | 10.2,17.4 R24.1 | BU4331G-TR56.3 6.85,20.25 6.6,20 R7.2 | C21.2 4.9,21.4 5.1,21.2 5.7,21.2 6.05,20.85 R7.2 | C23.2 10.95,21.85 11.4,21.4 | 11.4,21.4 11.4,20 11.1,19.7 9.6,19.7 9.4,19.5 9.4,17.9 v9.8,17.5 | 9.85,17.55 R24.1 | 25.8,21.25 U$21.6 22.25,21.25 22.1,21.4 22.45,21.75 | 25.8,21.25 26.7,21.25 C26.2 | 25.8,21.25 25.3,21.75 U$21.5 23.55,21.75 | 28.25,22.15 C25.2 27.9,21.65 v27.9,21.4 27.5,21.4 27.25,21.15 C26.2 | 22.45,21.75 22.05,21.75 U$21.GND@1 | U$21.GND@2 23.25,22.15 U$21.GND@3 23.55,21.75 | 23.55,21.75 22.45,21.75 | U$24.CATHODE v38.1,25.4 | v38.1,21.9 U$24.EMITTER 38.35,20.7 40.7,20.7 | v35.6,28.2 35,28.8 35,30.3 35.6,31.1 35.6,31.38 U$22.5 35.35,32.4 34.1,32.4 33.8,32.7 33.8,36.9 35.9,39 36,39 | U$23.P$1 40.7,21.2 40.7,20.7 | 16.7,8.75 R9.1 v16.7,8.1 | U$25.5 12.7,19.9 13,20.2 13,21.6 12.65,21.95 R10.1 11.95,21.95 11.4,21.4 | C26.2 27.05,21.4 | U$12.2 6.85,28.45 6.4,28 5.3,28 5.1,28.2 5.1,28.9 4.9,29.1 4.2,29.1 3,30.3 | 3,30.3 2.95,30.35 U$11.2 3.05,30.8 | v6.7,19.3 6.5,19.1 6.5,18.7 | STWD100PYW83F56.2 9.6,17.3 v9.8,17.5 | v9.8,17.5 10.15,17.5 R24.1
  Bottom 0.25: C5.2 40.8,16.6 41.05,16.85 R6.2 | MPPT2.3 MPPT2.EXP | U$2.15 4.25,8.85 4.5,8.6 4.75,8.85 U$2.14 4.75,11.05 U$2.17 | U$2.7 4.75,11.3 U$2.17 | U$2.9 5.25,12.05 | 5.25,12.05 arc90 U$2.17 | 5.25,12.05 U$2.8 5.88,12.78 | 5.25,12.05 arc-90 U$2.17 | U$2.4 3.75,12.05 | 3.75,12.05 arc-90 U$2.17 | U$2.5 3.75,12.05 | 3.75,12.05 arc90 U$2.17 | v6.3,13.2 5.88,12.78 | 5.88,12.78 5.9,12.75 5.9,12.1 | U$20.P$5 14.9,13.9 U$20.P$9
  Bottom 0.3: 23.6,11.52 23.29,11.29 22.84,11.74 22.23,12.35 R8.1 | 23.6,11.52 U1.11 | U1.11 23.8,11.3 24.31,11.81 | 24.31,11.29 U1.11 | U1.9 24.51,12.31 U1.11 | 23.49,11.29 U1.11 | U1.3 U1.11 | U1.2 24.51,11.29 U1.11 | U1.4 23.49,11.4 23.6,11.52 | PQ60_RECEPTACLE56.P$19 23.1,31.2 | U11.6 17.97,30.77 18.3,31.1 | PQ60_RECEPTACLE56.P$3 13.5,31.1 | U10.6 13.17,30.77 13.5,31.1 | 18.3,31.1 18.8,31.1 18.9,31.2 PQ60_HEADER56.P$12 | 18.3,31.1 PQ60_RECEPTACLE56.P$11 | PQ60_RECEPTACLE56.P$20 23.7,31.2 23.6,31.1 23,31.1 22.67,30.77 U12.6 | 13.5,31.1 14,31.1 14.1,31.2 PQ60_RECEPTACLE56.P$4 | PQ60_RECEPTACLE56.P$24 26.1,30.9 | PQ60_RECEPTACLE56.P$28 28.5,30.7 28.8,30.4 28.8,29.7 28.3,29.2 26.4,29.2 25.8,29.8 25.8,30.5 26.1,30.8 26.1,30.9 | PQ60_RECEPTACLE56.P$23 25.5,31 25.6,30.9 26.1,30.9 | U9.5 U9.7
  Bottom 0.4: 14.7,39.5 v15.6,39.5 16.5,39.5 | 19.5,39.5 20.1,39.5 v20.4,39.5 | 21.3,39.5 20.7,39.5 v20.4,39.5 | 34.8,3 34.8,3.4 33.1,5.1 33.1,7.15 33.7,7.75 33.7,8.7 | U$6.P$1 34.8,3 | C7.2 34.25,14.25 34.1,14.1 33.7,13.7 33.7,8.7 | C6.2 33.75,8.75 33.7,8.7 | C3.2 26.25,14.25 25.9,13.9 25.9,12.2 26.29,11.81 | 26.3,8.6 26.3,11.8 26.29,11.81 | 26.3,8.6 26.3,8 27.35,6.95 SOL3.P$1 27.35,1.8 | C2.2 26.45,8.75 arc90 26.3,8.6 | 24.31,11.81 26.29,11.81 | 4.5,8.6 4.5,8 4.5,7.75 R15.1 3,6.25 3,5.5 | 3,5.5 U$1.P$1 6.5,3 7.7,1.8 14.15,1.8 | v4.2,11 3.9,11 3.9,11.5 | 3.9,11.5 3.9,11.7 | v4.9,11.7 4.8,11.5 3.9,11.5 | 14.15,1.8 17.55,1.8 | 17.55,1.8 22.45,1.8 | 22.45,1.8 27.35,1.8 | 27.35,1.8 32.25,1.8 | 32.25,1.8 34.1,1.8 34.8,2.5 34.8,3 | SOL4.P$1 32.25,1.8 | SOL2.P$1 22.45,1.8 | SOL1.P$1 17.55,1.8 | BAT56.P$1 14.15,1.8 | U$20.P$9 v13,13.9 v15.6,13.9 | U$7.P$1 36,39 | 31.5,39 29.4,41.1 21.3,41.1 20.4,40.2 v20.4,39.5 | v1.6,10.3 0.8,9.5 0.8,6 1.2,5.6 2.9,5.6 3,5.5
  other vias: 14.3,10.5
  pour Bottom (isolate 0.3): 0,0 42,0 42,42 0,42
  pour Top (isolate 0.3): 0,0 42,0 42,42 0,42
GPIO0  (via drill 0.4)
  Top 0.2: PQ60_HEADER56.P$25 v26.7,30.1 28.6,28.2 31.9,28.2 33,27.1 33,26.3 32.6,25.9 28.3,25.9 26.6,24.2 23.6,24.2 23.1,23.7 20.1,23.7 19.6,23.2 18.5,23.2 17.6,22.3 v17.6,20.7
  Bottom 0.2: PQ60_RECEPTACLE56.P$25 v26.7,30.1 | U$21.17 18.05,20.25 v17.6,20.7
GPIO1  (via drill 0.4)
  Top 0.2: PQ60_HEADER56.P$26 v27.3,34.5
  Bottom 0.2: v27.3,34.5 PQ60_RECEPTACLE56.P$26
GPIO2  (via drill 0.4)
  Top 0.2: PQ60_HEADER56.P$34 v27.9,35.5
  Bottom 0.2: v27.9,35.5 PQ60_RECEPTACLE56.P$34
GPIO3  (via drill 0.4)
  Top 0.2: PQ60_HEADER56.P$35 v27.3,39.2
  Bottom 0.2: v27.3,39.2 PQ60_RECEPTACLE56.P$35
GPIO4  (via drill 0.4)
  Top 0.2: PQ60_HEADER56.P$36 v26.7,35.5
  Bottom 0.2: v26.7,35.5 PQ60_RECEPTACLE56.P$36
GPIO5  (via drill 0.4)
  Top 0.2: PQ60_HEADER56.P$37 26.1,38.7 26.5,39.1 26.5,40 v26.6,40.1
  Bottom 0.2: PQ60_RECEPTACLE56.P$37 26.1,38.7 26.5,39.1 26.5,40 v26.6,40.1
GPIO6  (via drill 0.4)
  Top 0.2: PQ60_HEADER56.P$38 25.5,39.3 v25.6,39.4
  Bottom 0.2: PQ60_RECEPTACLE56.P$38 25.5,39.3 v25.6,39.4
GPIO7  (via drill 0.4)
  Top 0.2: PQ60_HEADER56.P$39 24.9,39 24.7,39.2 v24.7,40.1
  Bottom 0.2: PQ60_RECEPTACLE56.P$39 24.9,39 24.8,39.1 24.7,39.2 v24.7,40.1
GPIO8  (via drill 0.4)
  Top 0.2: PQ60_HEADER56.P$40 v24.3,35.5
  Bottom 0.2: v24.3,35.5 PQ60_RECEPTACLE56.P$40
GPIO9  (via drill 0.4)
  Top 0.2: PQ60_HEADER56.P$41 23.7,39.2 v23.8,39.3
  Bottom 0.2: PQ60_RECEPTACLE56.P$41 23.7,39.2 v23.8,39.3
GPIO10  (via drill 0.4)
  Top 0.2: PQ60_HEADER56.P$42 23.1,39 22.7,39.4 v22.6,39.4
  Bottom 0.2: PQ60_RECEPTACLE56.P$42 23.1,39 22.7,39.4 v22.6,39.4
GPIO11  (via drill 0.4)
  Top 0.2: PQ60_HEADER56.P$43 22.5,35.5 v22.6,35.4
  Bottom 0.2: PQ60_RECEPTACLE56.P$43 22.5,35.5 v22.6,35.4
GPIO12  (via drill 0.4)
  Top 0.2: PQ60_HEADER56.P$44 21.9,39.1 21.8,39.2 v21.8,40.2
  Bottom 0.2: PQ60_RECEPTACLE56.P$44 21.9,39.1 21.8,39.2 v21.8,40.2
MISO  (via drill 0.4)
  Top 0.2: PQ60_HEADER56.P$32 v29.1,35.5
  Bottom 0.2: v29.1,35.5 PQ60_RECEPTACLE56.P$32
MOSI  (via drill 0.4)
  Top 0.2: PQ60_HEADER56.P$31 29.7,39.2 v29.8,39.3
  Bottom 0.2: v29.8,39.3 29.7,39.2 PQ60_RECEPTACLE56.P$31
MPPT1  (via drill 0.4)
  Top 0.4: v24.5,9.2 24.7,9 26.3,9 27.4,10.1 v27.4,11.7 27.4,15.2 v27.1,15.5
  Bottom 0.25: MPPT1.9 29.1,13.4 28.9,13.2 28.6,13.2 28.4,13 28.4,10.6 28.25,10.45 C2.1 v27.4,11.7
  Bottom 0.3: U1.1 24.99,9.69 v24.5,9.2
  Bottom 0.4: R1.2 27.6,16 v27.1,15.5
MPPT2  (via drill 0.4)
  Top 0.4: v34.7,15.6 v34.7,11.7 31.3,8.3 23.7,8.3 v23,9
  Bottom 0.25: MPPT2.9 37.3,13.6 36.9,13.2 35.9,13.2 35.7,13 35.7,10.8 35.35,10.45 C6.1
  Bottom 0.3: U1.5 v23.01,9.01 v23,9
  Bottom 0.4: v34.7,11.7 C6.1 | R4.2 35.8,16.7 v34.7,15.6
MPPT_RAW  (via drill 0.4)
  Top 0.2: v19.9,12.4 17.7,10.2 17.7,4.4 18.1,4 19.4,4 20,3.4 20,2.6 19.4,2 7.5,2 6.3,3.2 6.3,4.2 4.3,6.2 3,6.2 0.6,8.6 0.6,32.3 1,32.7 v6.1,32.7
  Bottom 0.2: R26.2 6.75,32.7 v6.1,32.7 | v19.9,12.4 19.8,12.4 19.75,12.45 | 19.2,10.35 19.88,9.68 U$18.1
  Bottom 0.3: U1.6 23.01,13.91 23.2,14.1 24.8,14.1 24.99,13.91 U1.10 | 19.2,10.35 R13.1
  Bottom 0.4: 23.2,14.1 22.6,14.1 21.7,13.2 20.5,13.2 19.75,12.45 19.4,12.1 19.4,10.55 19.2,10.35
MPPTV_SENS  (via drill 0.4)
  Top 0.2: v20.6,25.7 18,28.3 12.3,28.3 11.4,27.4 7.4,27.4 v7.2,27.6
  Bottom 0.2: U$21.26 20.75,25.55 v20.6,25.7 | R27.2 R26.1 | R26.1 5.9,33.95 | v7.2,27.6 7.8,28.2 7.8,33.5 7.35,33.95 R26.1
MPPTV_SENS_EN  (via drill 0.4)
  Top 0.2: v22.2,25.5 22.2,26.8 21.2,27.8 20.1,27.8 18.8,29.1 11.9,29.1 11,28.2 10.1,28.2 8.3,30 v4.9,30
  Bottom 0.2: U$21.28 21.75,24.85 22.2,25.3 v22.2,25.5 | U$12.1 4.9,30.9 v4.9,30
N$1
  Bottom 0.25: MPPT1.7 30.1,13.5 29.6,13 29.6,11.6 29.27,11.28 IND1.P$1
N$2  (via drill 0.4)
  Top 0.4: v32.1,7.6 v22.2,7.6
  Bottom 0.25: MPPT1.6 30.6,13.5 30.7,13.4 31.2,13.4 32.73,11.88 IND1.P$3 32.6,10.72 C1.1
  Bottom 0.4: v32.1,7.6 32.73,8.22 IND1.P$3 | v22.2,7.6 21.76,7.6 U$31.P$1 20.46,6.34 19.7,7.1 18.1,7.1 17.8,6.8 17.8,6.5 17.6,6.3 U$32.P$1
N$3
  Bottom 0.25: MPPT2.7 38.3,13.5 36.58,11.78 IND2.P$1
N$4
  Bottom 0.2: MPPT1.10 28.6,13.8 28.5,13.7 28.3,13.7 27.9,13.3 27.9,13.1 27.75,12.95 C3.1
N$5
  Bottom 0.2: MPPT2.10 36.8,13.8 36.7,13.7 35.7,13.7 34.95,12.95 C7.1 34.75,12.75
N$6  (via drill 0.4)
  Top 0.4: v25.7,4.9 v35.2,4.9
  Bottom 0.25: MPPT2.6 38.8,13.5 40.02,12.28 | 40.02,12.28 IND2.P$3 | 40.02,12.28 40.8,13.05 C5.1
  Bottom 0.4: IND2.P$3 40.02,8.62 38.6,7.2 35.34,7.2 U$17.P$1 34.44,5.66 v35.2,4.9 | U$14.P$1 25.7,6.3 v25.7,4.9
N$7
  Bottom 0.2: MPPT2.1 36.8,17.1 36.6,17.3 36.6,19.1 36.25,19.45 R4.1 R5.2
N$8
  Bottom 0.2: MPPT1.2 29.1,17.2 28.8,17.5 28.8,18.7 29.5,19.4 30.2,19.4 30.7,19.9 C4.1
N$9
  Bottom 0.2: MPPT1.1 28.6,17.1 28.4,17.3 28.4,18.9 27.95,19.35 R1.1 R2.2
N$10
  Bottom 0.2: MPPT2.5 38.8,17.2 39.6,18 R6.1
N$11
  Bottom 0.2: MPPT2.2 37.3,17.2 37,17.5 37,18.7 37.7,19.4 38.95,19.4 C8.1
N$12  (via drill 0.4)
  Top 0.2: v25.4,14.7 26.5,13.6 26.5,10.9 25.7,10.1 22.8,10.1 21.3,8.6 21.3,7.1 21.7,6.7 32.7,6.7 35.6,9.6 35.6,15.4 v38.3,18.1
  Bottom 0.2: MPPT2.4 v38.3,18.1 | U$10.P$2 25.2,14.9 v25.4,14.7
N$13
  Bottom 0.4: SOL4.P$2 30.96,5.79 U$17.P$2
N$14  (via drill 0.4)
  Top 0.2: 30.1,17.6 v30.1,18.1 30.1,17.5 29.4,16.8 28.4,16.8 28,17.2 26.4,17.2 25.7,16.5 25,16.5 v24.7,16.8
  Bottom 0.2: MPPT1.4 v30.1,18.1 | U$4.P$2 23.7,17.5 24.4,16.8 v24.7,16.8
N$15
  Bottom 0.2: MPPT1.5 30.6,17.35 R3.1
N$16
  Bottom 0.4: SOL3.P$2 29.24,3 U$14.P$2
N$17
  Bottom 0.4: U$31.P$2 SOL2.P$2
N$18
  Bottom 0.4: U$32.P$2 18.74,3.31 SOL1.P$2
N$19
  Bottom 0.2: U$21.2 24.85,23.25 25,23.4 TP1.TP
N$29
  Bottom 0.2: R19.2 0.8,14.6 0.6,14.8 0.6,16.3 0.85,16.55 INA210AIDCKT56.4
  Bottom 0.25: U$2.2 2.25,11.05 2,11.3 2.25,11.55 U$2.3
  Bottom 0.4: 2,11.3 1.7,11.3 1.45,11.55 R19.2
N$30
  Bottom 0.2: R15.2 1.3,7.55 1.3,8.9 1.6,9.2 2.7,9.2 3,9.5 3,10.53 U$2.1
N$31
  Bottom 0.2: U$2.16 3.75,9.25 3.45,8.95 R16.2
N$32  (via drill 0.4)
  Top 0.2: v7.5,10.4 7.5,8.4 v5.9,6.8
  Bottom 0.2: U$2.12 7.35,10.55 v7.5,10.4 | v5.9,6.8 6.55,7.45 R17.2
N$33
  Bottom 0.2: R33.2 27.45,25.45 27.7,25.2 36.3,25.2 36.9,25.8 U$24.ANODE
N$35
  Bottom 0.2: R25.1 1.9,31.85 1.9,30.7 2.2,30.4 2.2,29.7 2,29.5 U$11.3
N$36
  Bottom 0.2: R27.1 5.9,31.65 U$12.3
N$37  (via drill 0.4)
  Top 0.4: v9.4,10.2 9.4,6.25 BAT56.P$2
  Bottom 0.2: INA210AIDCKT56.5 2,17.2 2.2,17 2.2,16 2.6,15.6 3,15.6 3.15,15.45 R19.1 | U$19.1 5.12,16.23 R22.2
  Bottom 0.4: v9.4,10.2 10,10.8 10,12.8 8.2,14.6 5.7,14.6 | R19.1 5.7,14.6 | R22.2 5.65,14.65 5.7,14.6
N$38
  Bottom 0.2: U$15.3 1.7,21.8 R21.1
N$39
  Bottom 0.2: R21.2 R20.1 3.3,18.9 2.9,18.5 2.9,18.1 3.15,17.85 INA210AIDCKT56.1
N$40
  Bottom 0.2: BU4331G-TR56.5 8.05,22.5 6.4,22.5 5.65,23.25 C21.1
N$43
  Bottom 0.2: STWD100PYW83F56.3 10.28,16.5 10.9,16.5 11.36,16.96 | 11.36,16.96 SJ1.2 | R24.2 10.45,18.85 10.45,18.45 10.7,18.2 11,18.2 11.3,17.9 11.3,17.02 11.36,16.96
N$44
  Bottom 0.2: U9.2 14.3,12 14.5,12.2 15.4,12.2 15.65,11.95 R40.2
OPTO
  Bottom 0.2: U$21.1 24.65,23.75 25,24.1 26.75,24.1 R33.1
SCK  (via drill 0.4)
  Top 0.2: PQ60_HEADER56.P$33 v28.5,39.2
  Bottom 0.2: v28.5,39.2 PQ60_RECEPTACLE56.P$33
SCL  (via drill 0.4)
  Top 0.2: v32.1,26.8 29.2,26.8 28.8,26.4 28.2,26.4 26.4,24.6 23.4,24.6 22.9,24.1 19.9,24.1 19.4,23.6 18.6,23.6 17.9,24.3 v17.9,24.7 | v30.2,34.7 29.8,34.7 29.1,34 PQ60_HEADER56.P$29 29.1,31.8
  Bottom 0.2: U$21.23 19.15,23.25 17.9,24.5 v17.9,24.7 | PQ60_RECEPTACLE56.P$29 29.1,34 29.8,34.7 v30.2,34.7 30.6,34.3 30.6,30.7 32.1,29.2 v32.1,26.8
SDA  (via drill 0.4)
  Top 0.2: v19,24.5 22.6,24.5 23.1,25 26.1,25 v28.4,27.3 | v29.7,30.8 PQ60_HEADER56.P$30
  Bottom 0.2: U$21.24 19.25,23.75 19,24 v19,24.5 | PQ60_RECEPTACLE56.P$30 v29.7,30.8 30.5,30 30.5,29.4 30,28.9 29.4,28.9 29.2,28.7 29.2,28 28.5,27.3 v28.4,27.3
SHDN  (via drill 0.4)
  Top 0.2: v35.9,20.8 34.9,20.8 30,15.9 28,15.9 27.6,16.3 26.8,16.3 26,15.5 25.1,15.5 24.5,14.9 24.5,13.7 20.7,9.9 19.9,9.9 19.5,10.3 19.5,11.3 19.8,11.6 20.3,11.6 20.8,12.1 20.8,12.9 20.4,13.3 20.4,15.5 v19.1,16.8
  Bottom 0.2: U$24.COLLECTOR 36.55,20.8 v35.9,20.8 | 19.76,16.8 U$4.P$1 | U$10.P$1 19.76,16.8 | 19.76,16.8 v19.1,16.8
SOL_ISEN  (via drill 0.4)
  Top 0.2: v21.2,14.1 21.2,11.7 v20.3,10.8
  Bottom 0.2: R8.2 20.45,11.05 v20.3,10.8 | U$21.13 21.75,18.95 20.7,17.9 20.7,17 20.2,16.5 20.2,15.9 20.7,15.4 20.7,14.6 v21.2,14.1
  Bottom 0.3: U$18.3 21.3,10.3 21.2,10.4 R8.2
SWDCLK  (via drill 0.4)
  Top 0.2: v35.4,26.4 38.2,29.1 | 38.2,29.1 v38.2,36.1 | v39.8,27.9 39.4,27.9 38.2,29.1
  Bottom 0.2: 37.26,33.16 U$22.4 37.26,33.06 38.2,34 v38.2,36.1 | v35.4,26.4 35,26 28.3,26 27.7,26.6 25.9,26.6 25.5,26.2 25.5,25.7 25.4,25.6 23.4,25.6 22.75,24.95 U$21.30 | v39.8,27.9 39.8,26.5 U$27.P$1
SWDIO  (via drill 0.4)
  Top 0.2: v41.1,33.3 41.5,32.9 41.5,28.3 39,25.8 39,21.5 38.5,21 37.7,21 37.2,21.5 v37.2,24.6
  Bottom 0.2: U$21.32 23.75,24.65 23.9,24.8 37,24.8 v37.2,24.6 38.3,23.5 U$28.P$1 | U$22.2 38.84,33.03 39.1,33.3 v41.1,33.3
SWDRST
  Bottom 0.2: U$21.31 23.25,24.85 23.6,25.2 25.7,25.2 25.9,25.4 25.9,26 26.1,26.2 27.5,26.2 28.1,25.6 36,25.6 36.3,25.9 36.3,27.7 36.5,27.9 37.7,27.9 38.2,28.4 | U$22.3 38.2,30.82 38.2,28.4 | U$16.P$1 39.3,24.6 39,24.9 39,27.6 38.2,28.4
SYS
  Bottom 0.25: U$2.11 6.65,11.05 6.9,11.3 6.65,11.55 U$2.10
  Bottom 0.4: PWR56.PIN2 8.03,11.3 6.9,11.3
SYS_RAW
  Bottom 0.2: 12.1,15.34 SJ1.1 12,13.7 13.6,12.1 13.7,12.1
  Bottom 0.25: U$20.P$7 14.1,12.5 13.7,12.1 | 13.7,11.58 U9.1 | U$20.P$8 13.7,12.1 | 13.7,12.1 13.64,12.04
  Bottom 0.35: U9.1 13.64,12.04
SYS_SW
  Bottom 0.2: U9.6 13.62,9.48 | PWR56.PIN1 11.27,12.33 8.95,14.65 STWD100PYW83F56.5 8.3,15.53 8.3,16.8 8.5,17 8.5,19.6 7.8,20.3 BU4331G-TR56.2 7.8,21.6 8.7,22.5 9.2,22.5 9.4,22.7 9.4,23.6 9.1,23.9 5.9,23.9 5.7,24.1 4.5,24.1 4.35,24.25 C22.1
  Bottom 0.25: R28.2 13.15,8.99 U9.6
  Bottom 0.4: PWR56.PIN1 11.27,11.03 12.82,9.48 13.62,9.48
USB_DISCONNECT  (via drill 0.4)
  Top 0.2: v29.63,29.68 31.62,29.68 33.8,27.5 33.8,25.9 33,25.1 28.8,25.1 24.8,21.1 v24.8,19.3
  Bottom 0.2: U12.2 23.33,26.57 23.5,26.4 24.3,26.4 24.5,26.6 24.5,27.1 24.6,27.2 25.4,27.2 25.7,27.5 26.3,27.5 26.95,28.15 R30.1 28.1,28.3 29.48,29.68 v29.63,29.68 | U$21.9 24.05,19.3 v24.8,19.3
WDI  (via drill 0.4)
  Top 0.2: v24.7,18 24.3,18 23.8,17.5 23.8,16.4 22.8,15.4 22,15.4 20.36,17.04 20.36,17.54 19.7,18.2 16.5,18.2 15.4,19.3 15.4,19.7 15,20.1 14,20.1 13.6,19.7 13.6,18.7 15.1,17.2 17.5,17.2 18.7,16 19,16 19.5,15.5 19.5,14.9 18.9,14.3 18.3,14.3 16.9,15.7 12.8,15.7 v11.2,14.1
  Bottom 0.2: STWD100PYW83F56.4 10.25,14.55 10.7,14.1 v11.2,14.1 | 23.25,19.55 23.2,19.5 | 23.25,19.55 23.25,18.85 23.4,18.7 24,18.7 v24.7,18 | 23.25,19.55 U$21.10
XTAL
  Bottom 0.2: U$21.8 24.85,20.25 25,20.1 28.7,20.1 30.2,21.6 32,21.6 33.05,22.65 U$8.4

## Text on the board
tPlace: PocketQube / EPS / Ver: 2.0 / Rev: A
tDocu: Copyright 2016 Satellite Applications Catapult | buildubo.co.uk | Designed and manufactured in the UK
BlindViaText: FillOverPAD:GND:185:436 | FillOverPAD:GND:184:436 | FillOverPAD:GND:183:436 | FillOverPAD:GND:182:436 | FillOverPAD:GND:177:436 | FillOverPAD:GND:176:436 | FillOverPAD:GND:175:436 | FillOverPAD:GND:174:436 | FillOverPAD:GND:125:436 | FillOverPAD:GND:124:436 | FillOverPAD:GND:123:436 | FillOverPAD:GND:122:436 | FillOverPAD:GND:117:436 | FillOverPAD:GND:116:436 | FillOverPAD:GND:115:436 | FillOverPAD:GND:114:436 | FillOverPAD:GND:72:436 | FillOverPAD:GND:73:436 | FillOverPAD:GND:76:436 | FillOverPAD:GND:77:436 | FillOverPAD:GND:80:436 | FillOverPAD:GND:81:436 | FillOverPAD:GND:84:436 | FillOverPAD:GND:85:436 | FillOverPAD:GND:88:436 | FillOverPAD:GND:89:436 | FillOverPAD:GND:92:436 | FillOverPAD:GND:93:436 | FillOverPAD:GND:97:436 | FillOverPAD:GND:132:436 | FillOverPAD:GND:133:436 | FillOverPAD:GND:136:436 | FillOverPAD:GND:137:436 | FillOverPAD:GND:140:436 | FillOverPAD:GND:141:436 | FillOverPAD:GND:144:436 | FillOverPAD:GND:145:436 | FillOverPAD:GND:148:436 | FillOverPAD:GND:149:436 | FillOverPAD:GND:152:436 | FillOverPAD:GND:153:436 | FillOverPAD:GND:157:436 | FillOverPAD:GND:370:436 | FillOverPAD:GND:297:436 | FillOverPAD:GND:300:436 | FillOverPAD:GND:418:436 | FillOverPAD:GND:426:436 | FillOverPAD:GND:434:436 | FillOverPAD:GND:374:436 | FillOverPAD:GND:27:436 | FillOverPAD:GND:305:436 | FillOverPAD:GND:364:436 | FillOverPAD:GND:25:436 | FillOverPAD:GND:29:436 | FillOverPAD:GND:210:436 | FillOverPAD:GND:363:436 | FillOverPAD:GND:365:436 | FillOverPAD:GND:335:436 | FillOverPAD:GND:31:436 | FillOverPAD:GND:5:436 | FillOverPAD:GND:336:436 | FillOverPAD:GND:33:436 | FillOverPAD:GND:372:436 | FillOverPAD:GND:205:436 | FillOverPAD:GND:15:436 | FillOverPAD:GND:376:436 | FillOverPAD:GND:23:436 | FillOverPAD:GND:381:436 | FillOverPAD:GND:320:436 | FillOverPAD:GND:230:436 | FillOverPAD:GND:194:436 | FillOverPAD:GND:197:436 | FillOverPAD:GND:200:436 | FillOverPAD:GND:203:436 | FillOverPAD:GND:39:436 | FillOverPAD:GND:261:436 | FillOverPAD:GND:50:436 | FillOverPAD:GND:61:436 | FillOverPAD:GND:58:436 | FillOverPAD:GND:9:436 | FillOverPAD:GND:69:436 | FillOverPAD:GND:17:436 | FillOverPAD:GND:330:436 | FillOverPAD:GND:13:436 | FillOverPAD:GND:21:436 | FillOverPAD:GND:271:436 | FillOverPAD:GND:273:436 | FillOverPAD:GND:274:436 | FillOverPAD:GND:326:436 | FillOverPAD:GND:248:436 | FillOverPAD:GND:403:436 | FillOverPAD:GND:270:436 | FillOverPAD:GND:275:436 | FillOverPAD:GND:387:436 | FillOverPAD:GND:206:436 | FillOverPAD:GND:405:436 | FillOverPAD:GND:283:436 | FillOverPAD:GND:412:436 | FillOverPAD:GND:281:436 | FillOverPAD:GND:280:436 | FillOverPAD:GND:410:436 | FillOverPAD:GND:398:436 | FillOverPAD:GND:397:436 | FillOverPAD:GND:396:436 | FillOverPAD:GND:208:436 | FillOverPAD:GND:314:436 | FillOverPAD:GND:11:436 | FillOverPAD:GND:19:436 | FillOverPAD:GND:216:436 | FillOverPAD:GND:218:436 | FillOverPAD:GND:214:436